# Altium schematic sheet PA-15-30W.SchDoc
size A4; SheetNumber: 3; SheetTotal: 5
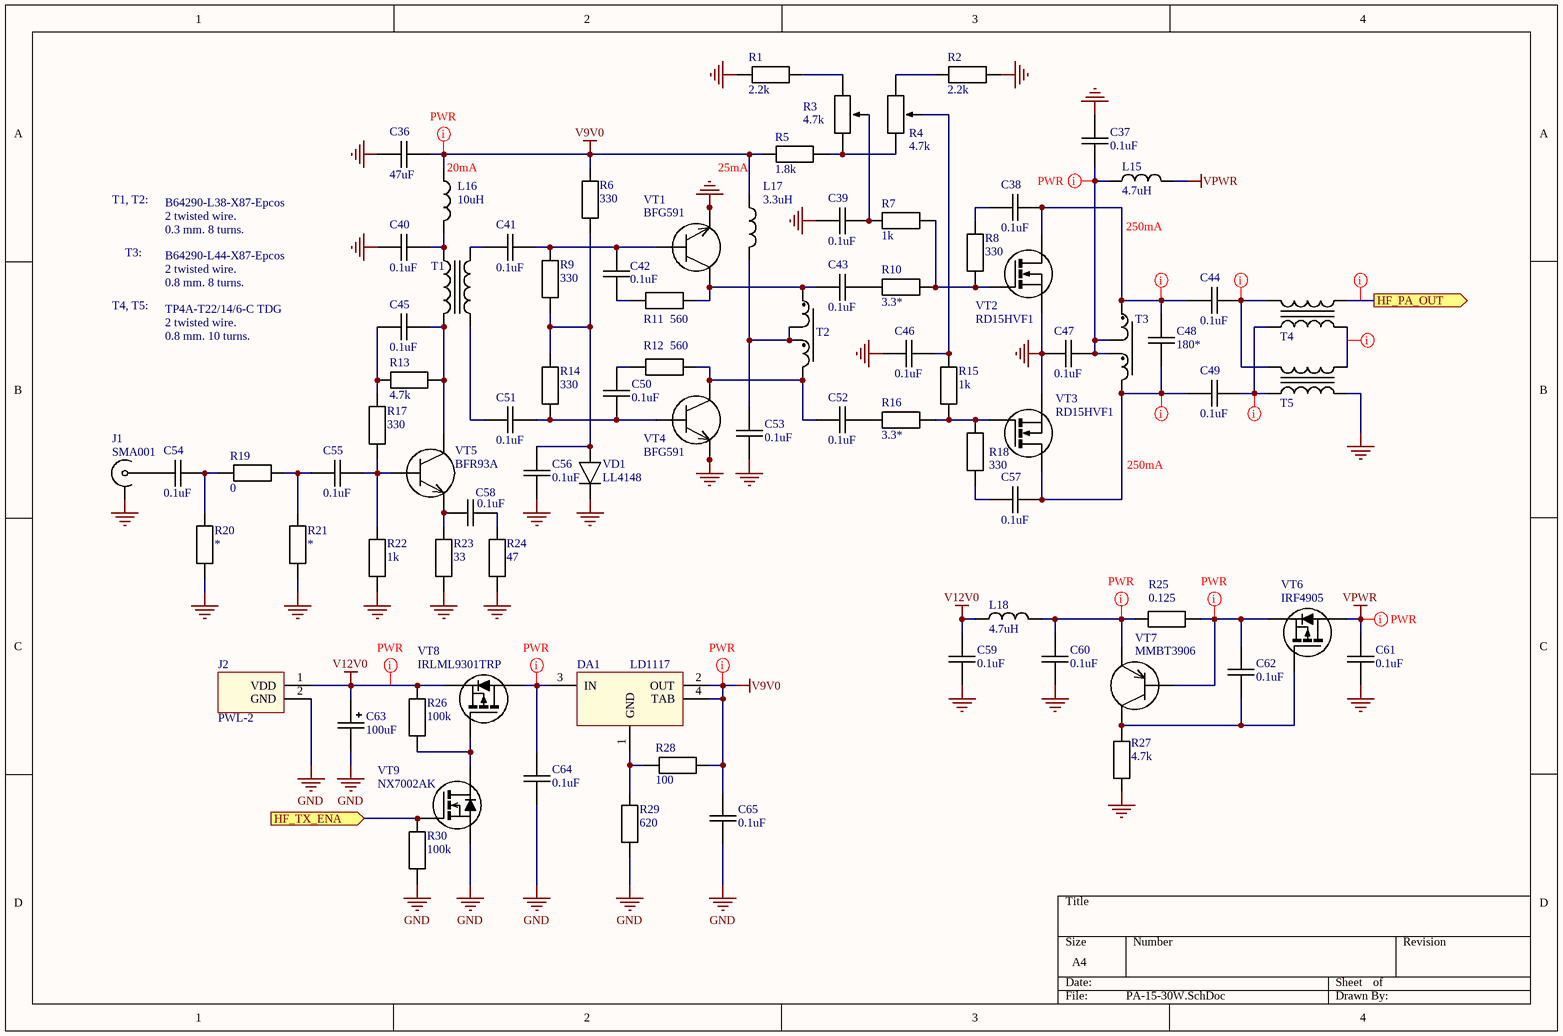
[diagram p0: PA-15-30W.SchDoc]

## Parts
C36  47uF  [CAPC3225X270N]
C37  0.1uF  [CAPC3216X125N]
C38  0.1uF  [CAPC2013X100N]
C39  0.1uF  [CAPC2013X100N]
C40  0.1uF  [CAPC2013X100N]
C41  0.1uF  [CAPC2013X100N]
C42  0.1uF  [CAPC2013X100N]
C43  0.1uF  [CAPC2013X100N]
C44  0.1uF  [CAPC4532X218N]
C45  0.1uF  [CAPC2013X100N]
C46  0.1uF  [CAPC2013X100N]
C47  0.1uF  [CAPC3216X125N]
C48  180*  [CAPC3216X125N]
C49  0.1uF  [CAPC4532X218N]
C50  0.1uF  [CAPC2013X100N]
C51  0.1uF  [CAPC2013X100N]
C52  0.1uF  [CAPC2013X100N]
C53  0.1uF  [CAPC2013X100N]
C54  0.1uF  [CAPC2013X100N]
C55  0.1uF  [CAPC2013X100N]
C56  0.1uF  [CAPC2013X100N]
C57  0.1uF  [CAPC2013X100N]
C58  0.1uF  [CAPC2013X100N]
C59  0.1uF  [CAPC2013X100N]
C60  0.1uF  [CAPC2013X100N]
C61  0.1uF  [CAPC2013X100N]
C62  0.1uF  [CAPC2013X100N]
C63  100uF  [CAPPR500-1050X1300]
C64  0.1uF  [CAPC2013X100N]
C65  0.1uF  [CAPC2013X100N]
DA1  LD1117  [SOT230P700X180-4N]
J1  SMA001  [SMA002]
J2  PWL-2  [PWL-2]
L15  4.7uH  [Inductor radial]
L16  10uH  [RESC2013X64N]
L17  3.3uH  [RES1270-650X250]
L18  4.7uH  [Inductor radial]
R1  2.2k  [RESC2013X64N]
R2  2.2k  [RESC2013X64N]
R3  4.7k  [3296W]
R4  4.7k  [3296W]
R5  1.8k  [RESC2013X64N]
R6  330  [RESC2013X64N]
R7  1k  [RESC2013X64N]
R8  330  [RESC2013X64N]
R9  330  [RESC2013X64N]
R10  3.3*  [RESC2013X64N]
R11  560  [RESC2013X64N]
R12  560  [RESC2013X64N]
R13  4.7k  [RESC2013X64N]
R14  330  [RESC2013X64N]
R15  1k  [RESC2013X64N]
R16  3.3*  [RESC2013X64N]
R17  330  [RESC2013X64N]
R18  330  [RESC2013X64N]
R19  0  [RESC2013X64N]
R20  *  [RESC2013X64N]
R21  *  [RESC2013X64N]
R22  1k  [RESC2013X64N]
R23  33  [RESC2013X64N]
R24  47  [RESC2013X64N]
R25  0.125  [RESC3216X80N]
R26  100k  [RESC2013X64N]
R27  4.7k  [RESC2013X64N]
R28  100  [RESC2013X64N]
R29  620  [RESC2013X64N]
R30  100k  [RESC2013X64N]
T1  R10*6*4 N87  [R10x6x4]  (value not drawn)
T2  R10*6*4 N87  [R10x6x4]  (value not drawn)
T3  R12,5*7,5*5 N87  [R12.5x7.5x5]  (value not drawn)
T4  TP4A-T22/14/6-C TDG  [R22x14x6]  (value not drawn)
T5  TP4A-T22/14/6-C TDG  [R22x14x6]  (value not drawn)
VD1  LL4148  [DIOMELF3515N]
VT1  BFG591  [SOT230P700X180-4N]
VT2  RD15HVF1  [TO-220-HFLIP]
VT3  RD15HVF1  [TO-220-HFLIP]
VT4  BFG591  [SOT230P700X180-4N]
VT5  BFR93A  [SOT95P229X119-3N]
VT6  IRF4905  [TO-220-v]
VT7  MMBT3906  [SOT95P229X119-3N]
VT8  IRLML9301TRP  [SOT95P229X119-3N]
VT9  NX7002AK  [SOT95P229X119-3N]

## Ports
HF_PA_OUT (out), HF_TX_ENA (in)

## Nets
GND: C36.1 C37.2 C39.2 C40.2 C46.1 C47.1 C53.2 C56.2 C59.2 C60.2 C61.2 C63.2 C64.1 C65.1 J1.2(GND) J2.2(GND) R1.1 R2.1 R20.1 R21.1 R22.1 R23.1 R24.1 R27.2 R29.1 R30.1 T5.3 VD1.1(C) VT1.1(E) VT1.3(E) VT2.2(S) VT3.2(S) VT4.1(E) VT4.3(E) VT9.2(S)
V9V0: C36.2 C65.2 DA1.2(OUT) DA1.4(TAB) L16.2 L17.2 R5.2 R6.2 R28.2
V12V0: C59.1 C63.1 J2.1(VDD) L18.1 R26.2 VT8.2(S)
VPWR: C61.1 L15.2 VT6.2(D)
HF_PA_OUT: T4.4 ; port HF_PA_OUT
HF_TX_ENA: R30.2 VT9.1(G) ; port HF_TX_ENA
NetC37_1: C37.1 C47.2 L15.1 T3.2 T3.4
NetC38_1: C38.1 C44.1 C48.2 T3.3 VT2.3(D)
NetC38_2: C38.2 R8.2
NetC39_1: C39.1 R3.2 R7.2
NetC40_1: C40.1 L16.1 T1.1
NetC41_1: C41.1 C42.2 R9.2 VT1.2(B)
NetC41_2: C41.2 T1.2
NetC42_1: C42.1 R11.1
NetC43_1: C43.1 R10.2
NetC43_2: C43.2 R11.2 T2.3 VT1.4(C)
NetC44_2: C44.2 T4.1 T5.1
NetC45_1: C45.1 R13.1 T1.4 VT5.3(C)
NetC45_2: C45.2 R13.2 R17.2
NetC46_2: C46.2 R4.2 R15.2
NetC48_1: C48.1 C49.1 C57.1 T3.1 VT3.3(D)
NetC49_2: C49.2 T4.2 T5.2
NetC50_1: C50.1 C51.1 R14.1 VT4.2(B)
NetC50_2: C50.2 R12.1
NetC51_2: C51.2 T1.3
NetC52_1: C52.1 R16.2
NetC52_2: C52.2 R12.2 T2.1 VT4.4(C)
NetC53_1: C53.1 L17.1 T2.2 T2.4
NetC54_1: C54.1 J1.1(RF)
NetC54_2: C54.2 R19.1 R20.2
NetC55_1: C55.1 R19.2 R21.2
NetC55_2: C55.2 R17.1 R22.2 VT5.1(B)
NetC56_1: C56.1 R6.1 R9.1 R14.2 VD1.2(A)
NetC57_2: C57.2 R18.1
NetC58_1: C58.1 R24.2
NetC58_2: C58.2 R23.2 VT5.2(E)
NetC60_1: C60.1 L18.2 R25.2 VT7.2(E)
NetC62_1: C62.1 R25.1 VT6.3(S) VT7.1(B)
NetC62_2: C62.2 R27.1 VT6.1(G) VT7.3(C)
NetC64_2: C64.2 DA1.3(IN) VT8.3(D)
NetDA1_1: DA1.1(GND) R28.1 R29.2
NetR1_2: R1.2 R3.3
NetR2_2: R2.2 R4.3
NetR3_1: R3.1 R4.1 R5.1
NetR7_1: R7.1 R8.1 R10.1 VT2.1(G)
NetR15_1: R15.1 R16.1 R18.2 VT3.1(G)
NetR26_1: R26.1 VT8.1(G) VT9.3(D)
NetT4_3: T4.3 T5.4

## Layout directives
net class OutPowerNet: HF_PA_OUT, NetC38_1, NetC44_2, NetC48_1, NetC49_2, NetT4_3
net class PowerLines: NetC37_1, NetC60_1, NetC62_1, NetC64_2, V9V0, V12V0, VPWR

## Notes on the sheet
- (near L16) 20mA
- 25mA
- T1, T2:
- В64290-L38-Х87-Epcos
  2 twisted wire.
  0.3 mm. 8 turns.
- (near L15) 250mA
- T4, T5:
- T3:
- B64290-L44-X87-Epcos
  2 twisted wire.
  0.8 mm. 8 turns.
- TP4A-T22/14/6-C TDG
  2 twisted wire.
  0.8 mm. 10 turns.
- 250mA

## Library data of the parts
C36 = Cap1210: GRM32ER71A476KE15L
C37 = Cap1206: FM31X104K251EEG
C38-C43 C45 C46 C50-C62 C64 C65 = Cap0805: Capacitor 2x1.25 mm
C44 C49 = Cap1812: GRM43DR72J104KW01 (1812, X7R:EIA, 0.1uF, DC630V), rcs
C47 = Cap1206: FM31X104K251EEG, rcs
C48 = Cap1206: 1206, NP0, 1kV
C63 = CapPolarized: EEUFR1E471, imrad
DA1 = LD1117: Adjustable and fixed low drop positive voltage regulator
J1 = RF Connector
J2 = PWR_CONNECTOR
L15 L18 = Inductor: Bochen, 4.7µH±10%, Idc=5.0А, Rdc мax=0.05
L16 = Inductor: SMD 0805 50-100mA / LQM21FN100M70L, Imrad
L17 = Inductor: 3,3uH ±10% аксиальный дроссель 670mA 0,34Ohm (KLS18-EC36-3R3K-A – KLS)
R1 R2 R5-R24 R26-R30 = Res0805
R3 = potentiometer: 4,7 kOhm 3296W (KLS4-3296W-472), rcs
R4 = potentiometer
R25 = Res0805: 8 items 1 Om in paralel,1206
T1 = transformer type 2: R10*6*4 N87 (В64290-L38-Х87-Epcos)
T2 = transformer type 1: R10*6*4 N87 (В64290-L38-Х87-Epcos); pin to pad: 1>4 2>3 3>2 4>1
T3 = transformer type 1: R12,5*7,5*5 N87 (B64290-L44-X87-Epcos)
T4 T5 = transformer type 2
VD1 = DIODE
VT1 VT4 = BFG591: NPN 7 GHz wideband transistor
VT5 = BFR93A: NPN 6 GHz wideband transistor
VT6 = IRF4905: HEXFET® Power MOSFET
VT7 = MMBT3906: MMBT3906LT1G, PNP General Purpose Amplifier / imrad
VT9 = N-MOSFET 1G 2S 3D